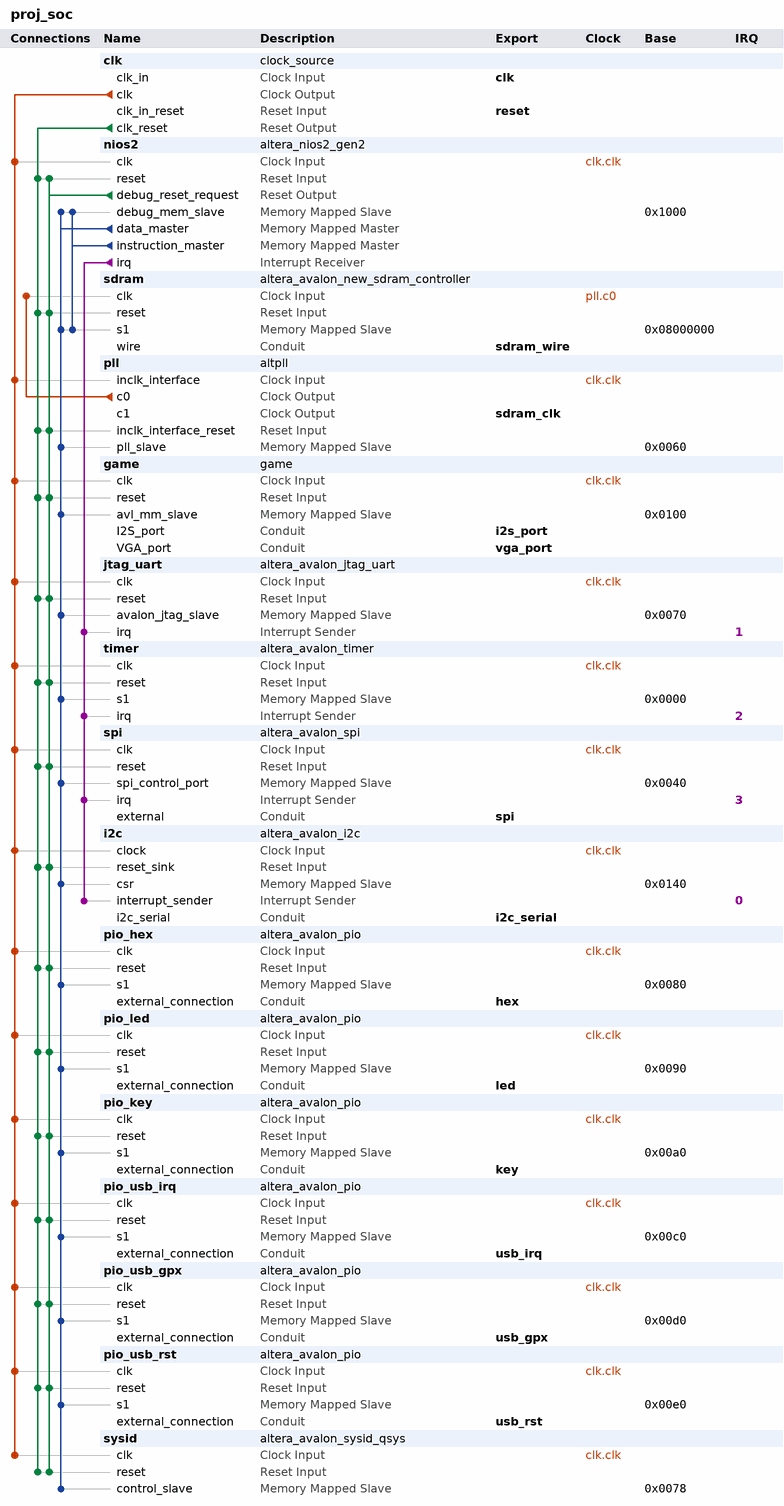
[diagram p0: system contents]
# Platform Designer (Qsys) system proj_soc, MAX 10 10M50DAF484C7G
# Parameters at their usual value, and those the tool derives, are not listed.
package require -exact qsys 18.1
create_system proj_soc
set_project_property DEVICE_FAMILY {MAX 10}
set_project_property DEVICE 10M50DAF484C7G

add_instance clk clock_source 18.1
set_instance_parameter_value clk clockFrequency 50000000

add_instance nios2 altera_nios2_gen2 18.1
set_instance_parameter_value nios2 dcache_size 2048
set_instance_parameter_value nios2 exceptionSlave sdram.s1
set_instance_parameter_value nios2 icache_size 4096
set_instance_parameter_value nios2 impl Tiny
set_instance_parameter_value nios2 resetSlave sdram.s1

add_instance sdram altera_avalon_new_sdram_controller 18.1
set_instance_parameter_value sdram TAC 5.4
set_instance_parameter_value sdram TRCD 20.0
set_instance_parameter_value sdram TRP 20.0
set_instance_parameter_value sdram casLatency 3
set_instance_parameter_value sdram columnWidth 10
set_instance_parameter_value sdram dataWidth 16
set_instance_parameter_value sdram generateSimulationModel false
set_instance_parameter_value sdram model single_Micron_MT48LC4M32B2_7_chip
set_instance_parameter_value sdram numberOfBanks 4
set_instance_parameter_value sdram numberOfChipSelects 1
set_instance_parameter_value sdram powerUpDelay 200.0
set_instance_parameter_value sdram refreshPeriod 15.625
set_instance_parameter_value sdram rowWidth 13

add_instance pll altpll 18.1
set_instance_parameter_value pll CLK0_DIVIDE_BY 1
set_instance_parameter_value pll CLK0_MULTIPLY_BY 1
set_instance_parameter_value pll CLK1_DIVIDE_BY 1
set_instance_parameter_value pll CLK1_DUTY_CYCLE 50
set_instance_parameter_value pll CLK1_MULTIPLY_BY 1
set_instance_parameter_value pll CLK1_PHASE_SHIFT -1000
set_instance_parameter_value pll INCLK0_INPUT_FREQUENCY 20000
set_instance_parameter_value pll PORT_ARESET PORT_UNUSED
set_instance_parameter_value pll PORT_LOCKED PORT_UNUSED
set_instance_parameter_value pll PORT_clk1 PORT_USED
set_instance_parameter_value pll PORT_clk2 PORT_UNUSED
set_instance_parameter_value pll PORT_clk3 PORT_UNUSED

add_instance game game 1.1

add_instance jtag_uart altera_avalon_jtag_uart 18.1
set_instance_parameter_value jtag_uart simInteractiveOptions NO_INTERACTIVE_WINDOWS

add_instance timer altera_avalon_timer 18.1
set_instance_parameter_value timer counterSize 64
set_instance_parameter_value timer period 1
set_instance_parameter_value timer periodUnits MSEC

add_instance spi altera_avalon_spi 18.1
set_instance_parameter_value spi clockPolarity 0
set_instance_parameter_value spi dataWidth 8
set_instance_parameter_value spi masterSPI true
set_instance_parameter_value spi numberOfSlaves 1
set_instance_parameter_value spi targetClockRate 2500000

add_instance i2c altera_avalon_i2c 18.1
set_instance_parameter_value i2c FIFO_DEPTH 4

add_instance pio_hex altera_avalon_pio 18.1
set_instance_parameter_value pio_hex direction Output
set_instance_parameter_value pio_hex width 24

add_instance pio_led altera_avalon_pio 18.1
set_instance_parameter_value pio_led direction Output
set_instance_parameter_value pio_led width 10

add_instance pio_key altera_avalon_pio 18.1
set_instance_parameter_value pio_key direction Input
set_instance_parameter_value pio_key width 2

add_instance pio_usb_irq altera_avalon_pio 18.1
set_instance_parameter_value pio_usb_irq direction Input
set_instance_parameter_value pio_usb_irq width 1

add_instance pio_usb_gpx altera_avalon_pio 18.1
set_instance_parameter_value pio_usb_gpx direction Input
set_instance_parameter_value pio_usb_gpx width 1

add_instance pio_usb_rst altera_avalon_pio 18.1
set_instance_parameter_value pio_usb_rst direction Output
set_instance_parameter_value pio_usb_rst width 1

add_instance sysid altera_avalon_sysid_qsys 18.1
set_instance_parameter_value sysid id 0

# connections
add_connection clk.clk game.clk clock
add_connection clk.clk i2c.clock clock
add_connection clk.clk jtag_uart.clk clock
add_connection clk.clk nios2.clk clock
add_connection clk.clk pio_hex.clk clock
add_connection clk.clk pio_key.clk clock
add_connection clk.clk pio_led.clk clock
add_connection clk.clk pio_usb_gpx.clk clock
add_connection clk.clk pio_usb_irq.clk clock
add_connection clk.clk pio_usb_rst.clk clock
add_connection clk.clk pll.inclk_interface clock
add_connection clk.clk spi.clk clock
add_connection clk.clk sysid.clk clock
add_connection clk.clk timer.clk clock
add_connection pll.c0 sdram.clk clock
add_connection clk.clk_reset game.reset reset
add_connection clk.clk_reset i2c.reset_sink reset
add_connection clk.clk_reset jtag_uart.reset reset
add_connection clk.clk_reset nios2.reset reset
add_connection clk.clk_reset pio_hex.reset reset
add_connection clk.clk_reset pio_key.reset reset
add_connection clk.clk_reset pio_led.reset reset
add_connection clk.clk_reset pio_usb_gpx.reset reset
add_connection clk.clk_reset pio_usb_irq.reset reset
add_connection clk.clk_reset pio_usb_rst.reset reset
add_connection clk.clk_reset pll.inclk_interface_reset reset
add_connection clk.clk_reset sdram.reset reset
add_connection clk.clk_reset spi.reset reset
add_connection clk.clk_reset sysid.reset reset
add_connection clk.clk_reset timer.reset reset
add_connection nios2.debug_reset_request game.reset reset
add_connection nios2.debug_reset_request i2c.reset_sink reset
add_connection nios2.debug_reset_request jtag_uart.reset reset
add_connection nios2.debug_reset_request nios2.reset reset
add_connection nios2.debug_reset_request pio_hex.reset reset
add_connection nios2.debug_reset_request pio_key.reset reset
add_connection nios2.debug_reset_request pio_led.reset reset
add_connection nios2.debug_reset_request pio_usb_gpx.reset reset
add_connection nios2.debug_reset_request pio_usb_irq.reset reset
add_connection nios2.debug_reset_request pio_usb_rst.reset reset
add_connection nios2.debug_reset_request pll.inclk_interface_reset reset
add_connection nios2.debug_reset_request sdram.reset reset
add_connection nios2.debug_reset_request spi.reset reset
add_connection nios2.debug_reset_request sysid.reset reset
add_connection nios2.debug_reset_request timer.reset reset
add_connection nios2.data_master game.avl_mm_slave avalon
set_connection_parameter_value nios2.data_master/game.avl_mm_slave baseAddress 0x0100
add_connection nios2.data_master i2c.csr avalon
set_connection_parameter_value nios2.data_master/i2c.csr baseAddress 0x0140
add_connection nios2.data_master jtag_uart.avalon_jtag_slave avalon
set_connection_parameter_value nios2.data_master/jtag_uart.avalon_jtag_slave baseAddress 0x0070
add_connection nios2.data_master nios2.debug_mem_slave avalon
set_connection_parameter_value nios2.data_master/nios2.debug_mem_slave baseAddress 0x1000
add_connection nios2.data_master pio_hex.s1 avalon
set_connection_parameter_value nios2.data_master/pio_hex.s1 baseAddress 0x0080
add_connection nios2.data_master pio_key.s1 avalon
set_connection_parameter_value nios2.data_master/pio_key.s1 baseAddress 0x00a0
add_connection nios2.data_master pio_led.s1 avalon
set_connection_parameter_value nios2.data_master/pio_led.s1 baseAddress 0x0090
add_connection nios2.data_master pio_usb_gpx.s1 avalon
set_connection_parameter_value nios2.data_master/pio_usb_gpx.s1 baseAddress 0x00d0
add_connection nios2.data_master pio_usb_irq.s1 avalon
set_connection_parameter_value nios2.data_master/pio_usb_irq.s1 baseAddress 0x00c0
add_connection nios2.data_master pio_usb_rst.s1 avalon
set_connection_parameter_value nios2.data_master/pio_usb_rst.s1 baseAddress 0x00e0
add_connection nios2.data_master pll.pll_slave avalon
set_connection_parameter_value nios2.data_master/pll.pll_slave baseAddress 0x0060
add_connection nios2.data_master sdram.s1 avalon
set_connection_parameter_value nios2.data_master/sdram.s1 baseAddress 0x08000000
add_connection nios2.data_master spi.spi_control_port avalon
set_connection_parameter_value nios2.data_master/spi.spi_control_port baseAddress 0x0040
add_connection nios2.data_master sysid.control_slave avalon
set_connection_parameter_value nios2.data_master/sysid.control_slave baseAddress 0x0078
add_connection nios2.data_master timer.s1 avalon
set_connection_parameter_value nios2.data_master/timer.s1 baseAddress 0x0000
add_connection nios2.instruction_master nios2.debug_mem_slave avalon
set_connection_parameter_value nios2.instruction_master/nios2.debug_mem_slave baseAddress 0x1000
add_connection nios2.instruction_master sdram.s1 avalon
set_connection_parameter_value nios2.instruction_master/sdram.s1 baseAddress 0x08000000
add_connection nios2.irq i2c.interrupt_sender interrupt
set_connection_parameter_value nios2.irq/i2c.interrupt_sender irqNumber 0
add_connection nios2.irq jtag_uart.irq interrupt
set_connection_parameter_value nios2.irq/jtag_uart.irq irqNumber 1
add_connection nios2.irq spi.irq interrupt
set_connection_parameter_value nios2.irq/spi.irq irqNumber 3
add_connection nios2.irq timer.irq interrupt
set_connection_parameter_value nios2.irq/timer.irq irqNumber 2

# exported interfaces
add_interface clk clock sink
set_interface_property clk EXPORT_OF clk.clk_in
add_interface hex conduit end
set_interface_property hex EXPORT_OF pio_hex.external_connection
add_interface i2c_serial conduit end
set_interface_property i2c_serial EXPORT_OF i2c.i2c_serial
add_interface i2s_port conduit end
set_interface_property i2s_port EXPORT_OF game.I2S_port
add_interface key conduit end
set_interface_property key EXPORT_OF pio_key.external_connection
add_interface led conduit end
set_interface_property led EXPORT_OF pio_led.external_connection
add_interface reset reset sink
set_interface_property reset EXPORT_OF clk.clk_in_reset
add_interface sdram_clk clock source
set_interface_property sdram_clk EXPORT_OF pll.c1
add_interface sdram_wire conduit end
set_interface_property sdram_wire EXPORT_OF sdram.wire
add_interface spi conduit end
set_interface_property spi EXPORT_OF spi.external
add_interface usb_gpx conduit end
set_interface_property usb_gpx EXPORT_OF pio_usb_gpx.external_connection
add_interface usb_irq conduit end
set_interface_property usb_irq EXPORT_OF pio_usb_irq.external_connection
add_interface usb_rst conduit end
set_interface_property usb_rst EXPORT_OF pio_usb_rst.external_connection
add_interface vga_port conduit end
set_interface_property vga_port EXPORT_OF game.VGA_port

set_interconnect_requirement {$system} qsys_mm.clockCrossingAdapter HANDSHAKE
set_interconnect_requirement {$system} qsys_mm.enableEccProtection FALSE
set_interconnect_requirement {$system} qsys_mm.insertDefaultSlave FALSE
set_interconnect_requirement {$system} qsys_mm.maxAdditionalLatency 1

save_system proj_soc.qsys
